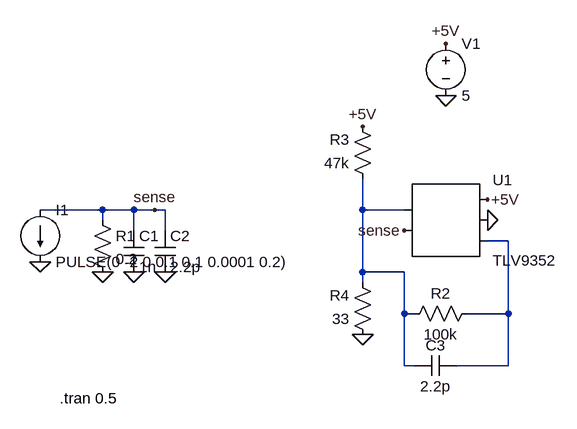
[diagram p0: schematic Currentsensor.asc]
Currentsensor.asc, the LTspice schematic file:
Version 4
SHEET 1 880 680
WIRE -112 48 -208 48
WIRE -64 48 -112 48
WIRE -32 48 -64 48
WIRE -16 48 -32 48
WIRE 288 48 288 0
WIRE 352 48 288 48
WIRE -112 64 -112 48
WIRE -64 80 -64 48
WIRE -16 80 -16 48
WIRE 512 96 480 96
WIRE 288 144 288 48
WIRE 352 144 288 144
WIRE 288 160 288 144
WIRE 352 208 352 144
WIRE 368 208 352 208
WIRE 512 208 512 96
WIRE 512 208 448 208
WIRE 352 288 352 208
WIRE 368 288 352 288
WIRE 512 288 512 208
WIRE 512 288 432 288
FLAG 416 -128 0
FLAG 480 64 0
FLAG 480 32 +5V
FLAG 416 -208 +5V
FLAG 288 240 0
FLAG -112 144 0
FLAG -64 144 0
FLAG -16 144 0
FLAG -32 48 sense
FLAG 352 80 sense
FLAG -208 128 0
FLAG 288 -80 +5V
SYMBOL AutoGenerated\\TLV9352 416 64 R0
SYMATTR InstName U1
SYMBOL res -128 48 R0
SYMATTR InstName R1
SYMATTR Value 0.2
SYMBOL cap -80 80 R0
SYMATTR InstName C1
SYMATTR Value 1n
SYMBOL cap -32 80 R0
SYMATTR InstName C2
SYMATTR Value 2.2p
SYMBOL voltage 416 -224 R0
WINDOW 123 0 0 Left 0
WINDOW 39 0 0 Left 0
SYMATTR InstName V1
SYMATTR Value 5
SYMBOL res 464 192 R90
WINDOW 0 0 56 VBottom 2
WINDOW 3 32 56 VTop 2
SYMATTR InstName R2
SYMATTR Value 100k
SYMBOL res 304 16 R180
WINDOW 0 36 76 Left 2
WINDOW 3 36 40 Left 2
SYMATTR InstName R3
SYMATTR Value 47k
SYMBOL res 304 256 R180
WINDOW 0 36 76 Left 2
WINDOW 3 36 40 Left 2
SYMATTR InstName R4
SYMATTR Value 33
SYMBOL cap 432 272 R90
WINDOW 0 0 32 VBottom 2
WINDOW 3 32 32 VTop 2
SYMATTR InstName C3
SYMATTR Value 2.2p
SYMBOL current -208 48 R0
WINDOW 123 0 0 Left 0
WINDOW 39 0 0 Left 0
SYMATTR InstName I1
SYMATTR Value PULSE(0 -2 0 0.1 0.1 0.0001 0.2)
TEXT -178 338 Left 2 !.tran 0.5

The netlist it stands for:
* Currentsensor.asc
* U1: TLV9352 (symbol AutoGenerated\TLV9352 not available, pins judged from their places): pin1=N001 pin2=sense pin3=+5V pin4=0 pin5=N002
R1 sense 0 0.2
C1 sense 0 1n
C2 sense 0 2.2p
V1 +5V 0 5
R2 N002 N001 100k
R3 N001 +5V 47k
R4 0 N001 33
C3 N002 N001 2.2p
I1 sense 0 PULSE(0 -2 0 0.1 0.1 0.0001 0.2)
.tran 0.5
.backanno
.end